# Altium schematic sheet Battery protector.SchDoc
size A4
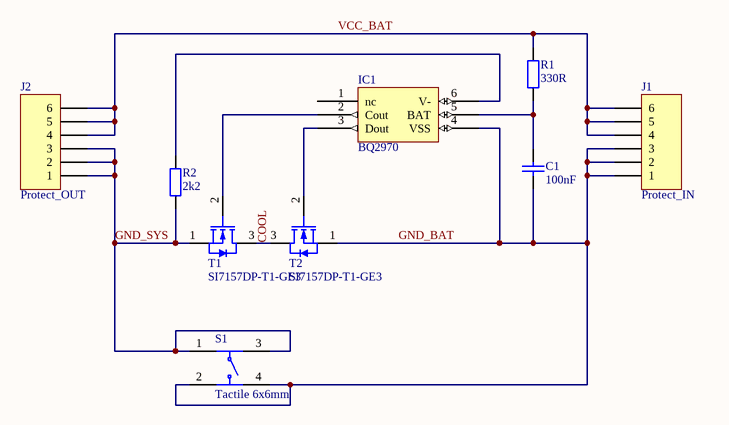
[diagram p0: Battery protector.SchDoc]

## Parts
C1  value 100nF  [0603 cap]  (hidden comment: Capacitor)
IC1  BQ2970  [PWSON-6]
J1  Protect_IN  [HDR1X6]
J2  Protect_OUT  [HDR1X6]
R1  value 330R  [0603 RES]  (hidden comment: Resistor generic)
R2  value 2k2  [0603 RES]  (hidden comment: Resistor generic)
S1  Tactile 6x6mm  [4301x20438x6]
T1  value SI7157DP-T1-GE3  [TDSON-8]  (hidden comment: MOSFET-N)
T2  value SI7157DP-T1-GE3  [TDSON-8]  (hidden comment: MOSFET-N)

## Nets
COOL: T1.3(D) T2.3(D)
GND_BAT: C1.1 IC1.4(VSS) J1.1 J1.2 J1.3 S1.2 S1.4 T2.1(S)
GND_SYS: J2.1 J2.2 J2.3 R2.1 S1.1 S1.3 T1.1(S)
VCC_BAT: J1.4 J1.5 J1.6 J2.4 J2.5 J2.6 R1.2
NetC1_2: C1.2 IC1.5(BAT) R1.1
NetIC1_2: IC1.2(Cout) T1.2(G)
NetIC1_3: IC1.3(Dout) T2.2(G)
NetIC1_6: IC1.6(V-) R2.2

Not connected (* = marked no-connect by the designer): IC1 1(nc)

## Library data of the parts
C1 = Capacitor NP: Voltage: >5V
IC1 = BQ2970: Battery protection IC; Value: BQ2970
J1 J2 = Header 6: Header, 6-Pin; LatestRevisionDate: 17-Jul-2002; LatestRevisionNote: Re-released for DXP Platform.; Publisher: Altium Limited
R1 R2 = Resistor: Resistor SMD
S1 = WS-TASV, 430152043826: WS-TASV 6x6 mm SMD; Manufacturer: Wurth Elektronik; partNo: 430152043826; ComponentLink1Description: Manufacturer; ComponentLink1URL: http://www.we-online.de; Created by: Baojun Chen; Created Date: Dec.2015; ComponentLink2Description: Datasheet; ComponentLink2URL: http://katalog.we-online.de/em/datasheet/4301x2xxx8x6.pdf
T1 T2 = MOSFET-N: MOSFET N; Voltage: *; Current: *